# Altium schematic sheet sample_conn.SchDoc: Hall / Hub Board / Sample Conn.
size A4; DocumentNumber: 6; SheetNumber: 6; SheetTotal: 7
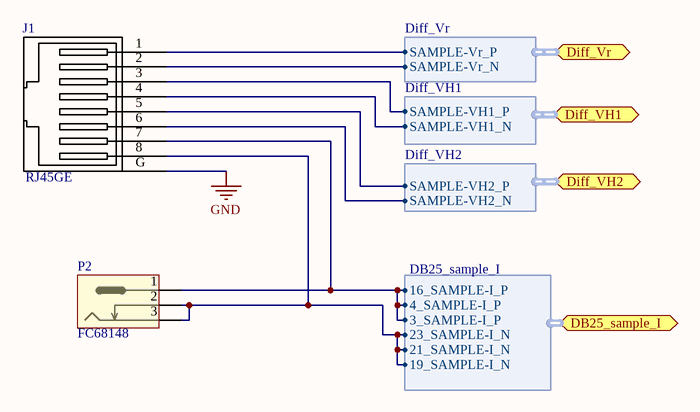
[diagram p0: sample_conn.SchDoc]

## Parts
J1  (no value)  [RJ45GE]
P2  Supplier Part Number 1: FC68148  [dc-jack]  (no BOM)

## Ports
DB25_sample_I (harness DB25_sample_I), Diff_VH1 (harness Diff_VH1), Diff_VH2 (harness Diff_VH2), Diff_Vr (harness Diff_Vr)

## Harnesses
Diff_Vr: SAMPLE-Vr_N, SAMPLE-Vr_P
Diff_VH1: SAMPLE-VH1_N, SAMPLE-VH1_P
DB25_sample_I: 16_SAMPLE-I_P, 19_SAMPLE-I_N, 21_SAMPLE-I_N, 23_SAMPLE-I_N, 3_SAMPLE-I_P, 4_SAMPLE-I_P
Diff_VH2: SAMPLE-VH2_N, SAMPLE-VH2_P

## Nets
GND: J1.G(GND)
NetJ1_1: J1.1 ; port Diff_Vr.SAMPLE-Vr_P
NetJ1_2: J1.2 ; port Diff_Vr.SAMPLE-Vr_N
NetJ1_3: J1.3 ; port Diff_VH1.SAMPLE-VH1_P
NetJ1_4: J1.4 ; port Diff_VH1.SAMPLE-VH1_N
NetJ1_5: J1.5 ; port Diff_VH2.SAMPLE-VH2_P
NetJ1_6: J1.6 ; port Diff_VH2.SAMPLE-VH2_N
NetJ1_7: J1.7 P2.1 ; port DB25_sample_I.16_SAMPLE-I_P, port DB25_sample_I.3_SAMPLE-I_P, port DB25_sample_I.4_SAMPLE-I_P
NetJ1_8: J1.8 P2.2 P2.3 ; port DB25_sample_I.19_SAMPLE-I_N, port DB25_sample_I.21_SAMPLE-I_N, port DB25_sample_I.23_SAMPLE-I_N

## Notes on the sheet
- Title
- Size:
- Date:
- A4
- Number:
- Time:
- Revision:
- Sheet
- of
- Fermium LABS srl
- Via Monselice 15a
- 35142 Padova PD
- Italy
- File:

## Library data of the parts
J1 = RJ45-GENERIC: Connector  RJ45 8 PIN; Manufacturer: NINIGI; Unit: pcs; SuppliedAmount: 0; MinAmount: 1; Connector: socket; Connector variant: shielded; Type of pin configuration: 8p8c; Electrical mounting: THT; Spatial orientation: angled 90°; Pads: 10 THT; Supplier 1: TME; Supplier Part Number 1: RJ45GE; Manufacturer Part Number: RJ45GE; Category: RJ connectors; Stock 1: 27637; Pricing 1: 1=0.609, 10=0.4872, 50=0.3897, 200=0.3045, 1000=0.2741 (EUR); Weight: 4.4; Multiples: 1; Connector type: RJ45; Number of pins: 8; Price Type: NET; ComponentLink1URL: http://static.tme.eu/products_pics/0/e/e/0ee711a9a85500572fe5689c7f237f48/338553.jpg; ComponentLink1Description: http://static.tme.eu/products_pics/0/e/e/0ee711a9a85500572fe5689c7f237f48/338553.jpg
P2 = jackdc: Manufacturer: CLIFF; Manufacturer Part Number: DC-10A FC68148; Unit: pcs; SuppliedAmount: 0; MinAmount: 1; Connector: socket; Connector type: DC supply; Contact size: 5,5/2,1mm; Plug outside diameter: 5.5mm; Plug inside diameter: 2.1mm; Connector variant: with on/off switch; Electrical mounting: soldering; Rated current: 5A; Rated voltage: 12V DC; Spatial orientation: angled 90°; Pads: 3 THT; Supplier 1: TME; Category: DC power connectors; Stock 1: 20287; Pricing 1: 1=0.4194, 20=0.3065, 100=0.2581, 500=0.2258 (USD); Weight: 1.733; Multiples: 1; Package type: in bulk; Price Type: NET; ComponentLink1URL: http://static.tme.eu/products_pics/f/8/e/f8eb2e1bea4ffe6692f5958f8ef9edd4/323250.jpg; ComponentLink1Description: http://static.tme.eu/products_pics/f/8/e/f8eb2e1bea4ffe6692f5958f8ef9edd4/323250.jpg